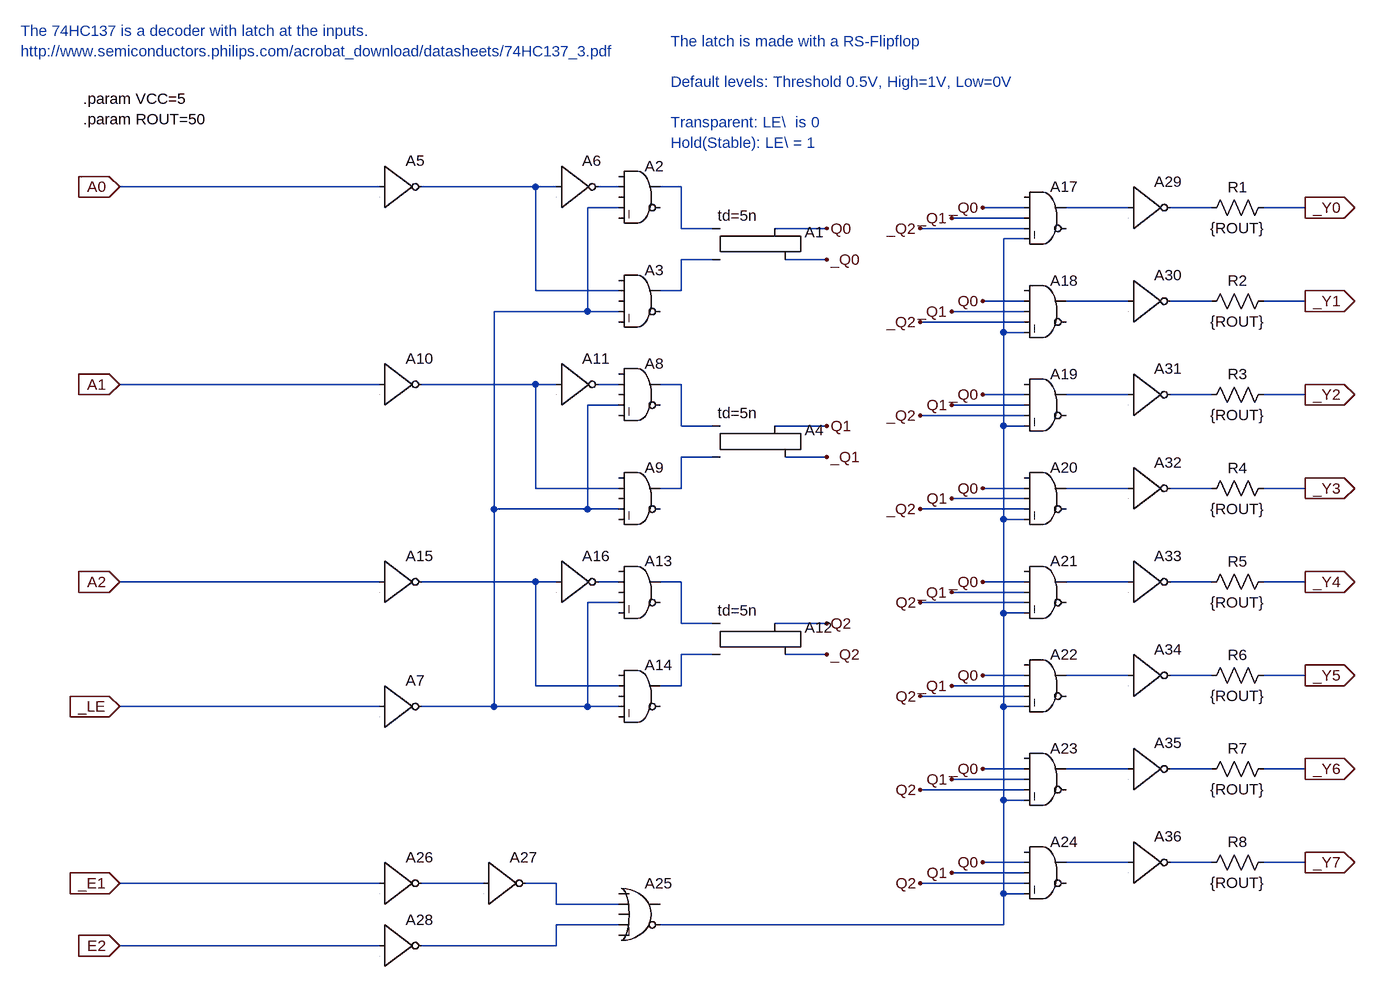
[diagram p0: schematic 74hc137.asc]
74hc137.asc, the LTspice schematic file:
Version 4
SHEET 1 1100 1908
WIRE -64 112 -96 112
WIRE -160 112 -192 112
WIRE -432 112 -832 112
WIRE -192 112 -192 272
WIRE -192 112 -368 112
WIRE -192 272 -64 272
WIRE -64 144 -112 144
WIRE -112 144 -112 304
WIRE -112 304 -64 304
WIRE -112 304 -256 304
WIRE 0 112 32 112
WIRE 32 112 32 176
WIRE 32 176 80 176
WIRE 0 272 32 272
WIRE 32 272 32 224
WIRE 32 224 80 224
WIRE 176 176 256 176
WIRE 192 224 256 224
WIRE -832 912 -432 912
WIRE -64 416 -96 416
WIRE -160 416 -192 416
WIRE -192 416 -192 576
WIRE -192 416 -368 416
WIRE -192 576 -64 576
WIRE -64 448 -112 448
WIRE -112 448 -112 608
WIRE -112 608 -64 608
WIRE 0 416 32 416
WIRE 32 416 32 480
WIRE 32 480 80 480
WIRE 0 576 32 576
WIRE 32 576 32 528
WIRE 32 528 80 528
WIRE 176 480 256 480
WIRE 192 528 256 528
WIRE -64 720 -96 720
WIRE -160 720 -192 720
WIRE -192 720 -192 880
WIRE -192 720 -368 720
WIRE -192 880 -64 880
WIRE -64 752 -112 752
WIRE -112 752 -112 912
WIRE -112 912 -64 912
WIRE 0 720 32 720
WIRE 32 720 32 784
WIRE 32 784 80 784
WIRE 0 880 32 880
WIRE 32 880 32 832
WIRE 32 832 80 832
WIRE 176 784 256 784
WIRE 192 832 256 832
WIRE -432 416 -832 416
WIRE -432 720 -832 720
WIRE 496 144 560 144
WIRE 560 160 448 160
WIRE 560 176 400 176
WIRE 560 192 528 192
WIRE 528 192 528 336
WIRE 496 288 560 288
WIRE 528 336 528 480
WIRE 496 432 560 432
WIRE 560 448 448 448
WIRE 560 464 400 464
WIRE 560 480 528 480
WIRE 528 480 528 624
WIRE 496 576 560 576
WIRE 560 592 448 592
WIRE 560 608 400 608
WIRE 560 624 528 624
WIRE 528 624 528 768
WIRE 496 720 560 720
WIRE 560 736 448 736
WIRE 560 752 400 752
WIRE 560 768 528 768
WIRE 528 768 528 912
WIRE 496 864 560 864
WIRE 560 880 448 880
WIRE 560 896 400 896
WIRE 560 912 528 912
WIRE 528 912 528 1056
WIRE 496 1008 560 1008
WIRE 560 1024 448 1024
WIRE 560 1040 400 1040
WIRE 560 1056 528 1056
WIRE 528 1056 528 1200
WIRE 496 1152 560 1152
WIRE 560 1168 448 1168
WIRE 560 1184 400 1184
WIRE 560 1200 528 1200
WIRE 528 1200 528 1248
WIRE -368 1184 -272 1184
WIRE -208 1184 -160 1184
WIRE -160 1184 -160 1216
WIRE -160 1216 -64 1216
WIRE -64 1248 -160 1248
WIRE -160 1248 -160 1280
WIRE -160 1280 -368 1280
WIRE -432 1184 -832 1184
WIRE -432 1280 -832 1280
WIRE 624 144 720 144
WIRE 624 288 720 288
WIRE 624 432 720 432
WIRE 624 576 720 576
WIRE 624 720 720 720
WIRE 624 864 720 864
WIRE 624 1008 720 1008
WIRE 624 1152 720 1152
WIRE 784 144 848 144
WIRE 784 288 848 288
WIRE 784 432 848 432
WIRE 784 576 848 576
WIRE 784 720 848 720
WIRE 784 864 848 864
WIRE 784 1008 848 1008
WIRE 784 1152 848 1152
WIRE 528 1248 0 1248
WIRE -112 608 -256 608
WIRE -256 608 -256 912
WIRE -256 912 -112 912
WIRE -256 608 -256 304
WIRE -368 912 -256 912
WIRE 560 304 448 304
WIRE 560 320 400 320
WIRE 560 336 528 336
WIRE 928 144 992 144
WIRE 928 288 992 288
WIRE 928 432 992 432
WIRE 928 576 992 576
WIRE 928 720 992 720
WIRE 928 864 992 864
WIRE 928 1008 992 1008
WIRE 928 1152 992 1152
FLAG -832 912 _LE
IOPIN -832 912 In
FLAG -832 112 A0
IOPIN -832 112 In
FLAG 256 176 Q0
FLAG 256 224 _Q0
FLAG 256 480 Q1
FLAG 256 528 _Q1
FLAG 256 784 Q2
FLAG 256 832 _Q2
FLAG -832 416 A1
IOPIN -832 416 In
FLAG -832 720 A2
IOPIN -832 720 In
FLAG 496 144 _Q0
FLAG 448 160 _Q1
FLAG 400 176 _Q2
FLAG 496 288 Q0
FLAG 448 304 _Q1
FLAG 400 320 _Q2
FLAG 496 432 _Q0
FLAG 448 448 Q1
FLAG 400 464 _Q2
FLAG 496 576 Q0
FLAG 448 592 Q1
FLAG 400 608 _Q2
FLAG 496 720 _Q0
FLAG 448 736 _Q1
FLAG 400 752 Q2
FLAG 496 864 Q0
FLAG 448 880 _Q1
FLAG 400 896 Q2
FLAG 496 1008 _Q0
FLAG 448 1024 Q1
FLAG 400 1040 Q2
FLAG 496 1152 Q0
FLAG 448 1168 Q1
FLAG 400 1184 Q2
FLAG 992 144 _Y0
IOPIN 992 144 Out
FLAG 992 288 _Y1
IOPIN 992 288 Out
FLAG 992 432 _Y2
IOPIN 992 432 Out
FLAG 992 576 _Y3
IOPIN 992 576 Out
FLAG 992 720 _Y4
IOPIN 992 720 Out
FLAG 992 864 _Y5
IOPIN 992 864 Out
FLAG 992 1008 _Y6
IOPIN 992 1008 Out
FLAG 992 1152 _Y7
IOPIN 992 1152 Out
FLAG -832 1280 E2
IOPIN -832 1280 In
FLAG -832 1184 _E1
IOPIN -832 1184 In
SYMBOL Digital\\srflop 128 128 R0
WINDOW 39 -40 28 Left 0
SYMATTR SpiceLine td=5n
SYMATTR InstName A1
SYMBOL Digital\\and -32 64 R0
SYMATTR InstName A2
SYMATTR SpiceLine td=5n
SYMBOL Digital\\and -32 224 R0
SYMATTR InstName A3
SYMATTR SpiceLine td=5n
SYMBOL Digital\\inv -432 48 R0
SYMATTR InstName A5
SYMATTR SpiceLine td=5n
SYMATTR SpiceLine2 ref={VCC/2}
SYMBOL Digital\\inv -160 48 R0
SYMATTR InstName A6
SYMBOL Digital\\inv -432 848 R0
SYMATTR InstName A7
SYMATTR SpiceLine td=5n
SYMATTR SpiceLine2 ref={VCC/2}
SYMBOL Digital\\srflop 128 432 R0
WINDOW 39 -40 28 Left 0
SYMATTR SpiceLine td=5n
SYMATTR InstName A4
SYMBOL Digital\\and -32 368 R0
SYMATTR InstName A8
SYMATTR SpiceLine td=5n
SYMBOL Digital\\and -32 528 R0
SYMATTR InstName A9
SYMATTR SpiceLine td=5n
SYMBOL Digital\\inv -432 352 R0
SYMATTR InstName A10
SYMATTR SpiceLine td=5n
SYMATTR SpiceLine2 ref={VCC/2}
SYMBOL Digital\\inv -160 352 R0
SYMATTR InstName A11
SYMBOL Digital\\srflop 128 736 R0
WINDOW 39 -40 28 Left 0
SYMATTR SpiceLine td=5n
SYMATTR InstName A12
SYMBOL Digital\\and -32 672 R0
SYMATTR InstName A13
SYMATTR SpiceLine td=5n
SYMBOL Digital\\and -32 832 R0
SYMATTR InstName A14
SYMATTR SpiceLine td=5n
SYMBOL Digital\\inv -432 656 R0
SYMATTR InstName A15
SYMATTR SpiceLine td=5n
SYMATTR SpiceLine2 ref={VCC/2}
SYMBOL Digital\\inv -160 656 R0
SYMATTR InstName A16
SYMBOL Digital\\and 592 96 R0
SYMATTR InstName A17
SYMATTR SpiceLine td=5n
SYMBOL Digital\\and 592 240 R0
SYMATTR InstName A18
SYMATTR SpiceLine td=5n
SYMBOL Digital\\and 592 384 R0
SYMATTR InstName A19
SYMATTR SpiceLine td=5n
SYMBOL Digital\\and 592 528 R0
SYMATTR InstName A20
SYMATTR SpiceLine td=5n
SYMBOL Digital\\and 592 672 R0
SYMATTR InstName A21
SYMATTR SpiceLine td=5n
SYMBOL Digital\\and 592 816 R0
SYMATTR InstName A22
SYMATTR SpiceLine td=5n
SYMBOL Digital\\and 592 960 R0
SYMATTR InstName A23
SYMATTR SpiceLine td=5n
SYMBOL Digital\\and 592 1104 R0
SYMATTR InstName A24
SYMATTR SpiceLine td=5n
SYMBOL Digital\\or -32 1168 R0
SYMATTR InstName A25
SYMATTR SpiceLine td=5n
SYMBOL Digital\\inv -432 1120 R0
SYMATTR InstName A26
SYMATTR SpiceLine td=5n
SYMATTR SpiceLine2 ref={VCC/2}
SYMBOL Digital\\inv -272 1120 R0
SYMATTR InstName A27
SYMBOL Digital\\inv -432 1216 R0
SYMATTR InstName A28
SYMATTR SpiceLine td=5n
SYMATTR SpiceLine2 ref={VCC/2}
SYMBOL Digital\\inv 720 80 R0
SYMATTR InstName A29
SYMATTR SpiceLine td=5n
SYMATTR SpiceLine2 ref=0.5  vlow=0 vhigh={VCC}
SYMBOL Digital\\inv 720 224 R0
SYMATTR InstName A30
SYMATTR SpiceLine td=5n
SYMATTR SpiceLine2 ref=0.5  vlow=0 vhigh={VCC}
SYMBOL Digital\\inv 720 368 R0
SYMATTR InstName A31
SYMATTR SpiceLine td=5n
SYMATTR SpiceLine2 ref=0.5  vlow=0 vhigh={VCC}
SYMBOL Digital\\inv 720 512 R0
SYMATTR InstName A32
SYMATTR SpiceLine td=5n
SYMATTR SpiceLine2 ref=0.5  vlow=0 vhigh={VCC}
SYMBOL Digital\\inv 720 656 R0
SYMATTR InstName A33
SYMATTR SpiceLine td=5n
SYMATTR SpiceLine2 ref=0.5  vlow=0 vhigh={VCC}
SYMBOL Digital\\inv 720 800 R0
SYMATTR InstName A34
SYMATTR SpiceLine td=5n
SYMATTR SpiceLine2 ref=0.5  vlow=0 vhigh={VCC}
SYMBOL Digital\\inv 720 944 R0
SYMATTR InstName A35
SYMATTR SpiceLine td=5n
SYMATTR SpiceLine2 ref=0.5  vlow=0 vhigh={VCC}
SYMBOL Digital\\inv 720 1088 R0
SYMATTR InstName A36
SYMATTR SpiceLine td=5n
SYMATTR SpiceLine2 ref=0.5  vlow=0 vhigh={VCC}
SYMBOL res 832 160 R270
WINDOW 0 32 56 VTop 0
WINDOW 3 0 56 VBottom 0
SYMATTR InstName R1
SYMATTR Value {ROUT}
SYMBOL res 832 304 R270
WINDOW 0 32 56 VTop 0
WINDOW 3 0 56 VBottom 0
SYMATTR InstName R2
SYMATTR Value {ROUT}
SYMBOL res 832 448 R270
WINDOW 0 32 56 VTop 0
WINDOW 3 0 56 VBottom 0
SYMATTR InstName R3
SYMATTR Value {ROUT}
SYMBOL res 832 592 R270
WINDOW 0 32 56 VTop 0
WINDOW 3 0 56 VBottom 0
SYMATTR InstName R4
SYMATTR Value {ROUT}
SYMBOL res 832 736 R270
WINDOW 0 32 56 VTop 0
WINDOW 3 0 56 VBottom 0
SYMATTR InstName R5
SYMATTR Value {ROUT}
SYMBOL res 832 880 R270
WINDOW 0 32 56 VTop 0
WINDOW 3 0 56 VBottom 0
SYMATTR InstName R6
SYMATTR Value {ROUT}
SYMBOL res 832 1024 R270
WINDOW 0 32 56 VTop 0
WINDOW 3 0 56 VBottom 0
SYMATTR InstName R7
SYMATTR Value {ROUT}
SYMBOL res 832 1168 R270
WINDOW 0 32 56 VTop 0
WINDOW 3 0 56 VBottom 0
SYMATTR InstName R8
SYMATTR Value {ROUT}
TEXT 16 -112 Left 0 ;The latch is made with a RS-Flipflop\n \nDefault levels: Threshold 0.5V, High=1V, Low=0V\n \nTransparent: LE\\  is 0\nHold(Stable): LE\\ = 1
TEXT -984 -128 Left 0 ;The 74HC137 is a decoder with latch at the inputs.\nhttp://www.semiconductors.philips.com/acrobat_download/datasheets/74HC137_3.pdf
TEXT -888 -24 Left 0 !.param VCC=5
TEXT -888 8 Left 0 !.param ROUT=50

The netlist it stands for:
* 74hc137.asc
A1 N004 N005 0 0 0 _Q0 Q0 0 SRFLOP td=5n
A2 0 N001 0 N003 0 0 N004 0 AND td=5n
A3 0 N002 0 N003 0 0 N005 0 AND td=5n
A5 A0 0 0 0 0 N002 0 0 BUF td=5n ref={VCC/2}
A6 N002 0 0 0 0 N001 0 0 BUF
A7 _LE 0 0 0 0 N003 0 0 BUF td=5n ref={VCC/2}
A4 N008 N009 0 0 0 _Q1 Q1 0 SRFLOP td=5n
A8 0 N006 0 N003 0 0 N008 0 AND td=5n
A9 0 N007 0 N003 0 0 N009 0 AND td=5n
A10 A1 0 0 0 0 N007 0 0 BUF td=5n ref={VCC/2}
A11 N007 0 0 0 0 N006 0 0 BUF
A12 N012 N013 0 0 0 _Q2 Q2 0 SRFLOP td=5n
A13 0 N010 0 N003 0 0 N012 0 AND td=5n
A14 0 N011 0 N003 0 0 N013 0 AND td=5n
A15 A2 0 0 0 0 N011 0 0 BUF td=5n ref={VCC/2}
A16 N011 0 0 0 0 N010 0 0 BUF
A17 0 _Q0 _Q1 _Q2 N014 0 N018 0 AND td=5n
A18 0 Q0 _Q1 _Q2 N014 0 N019 0 AND td=5n
A19 0 _Q0 Q1 _Q2 N014 0 N020 0 AND td=5n
A20 0 Q0 Q1 _Q2 N014 0 N021 0 AND td=5n
A21 0 _Q0 _Q1 Q2 N014 0 N022 0 AND td=5n
A22 0 Q0 _Q1 Q2 N014 0 N023 0 AND td=5n
A23 0 _Q0 Q1 Q2 N014 0 N024 0 AND td=5n
A24 0 Q0 Q1 Q2 N014 0 N025 0 AND td=5n
A25 0 N016 0 N017 0 N014 0 0 OR td=5n
A26 _E1 0 0 0 0 N015 0 0 BUF td=5n ref={VCC/2}
A27 N015 0 0 0 0 N016 0 0 BUF
A28 E2 0 0 0 0 N017 0 0 BUF td=5n ref={VCC/2}
A29 N018 0 0 0 0 N026 0 0 BUF td=5n ref=0.5  vlow=0 vhigh={VCC}
A30 N019 0 0 0 0 N027 0 0 BUF td=5n ref=0.5  vlow=0 vhigh={VCC}
A31 N020 0 0 0 0 N028 0 0 BUF td=5n ref=0.5  vlow=0 vhigh={VCC}
A32 N021 0 0 0 0 N029 0 0 BUF td=5n ref=0.5  vlow=0 vhigh={VCC}
A33 N022 0 0 0 0 N030 0 0 BUF td=5n ref=0.5  vlow=0 vhigh={VCC}
A34 N023 0 0 0 0 N031 0 0 BUF td=5n ref=0.5  vlow=0 vhigh={VCC}
A35 N024 0 0 0 0 N032 0 0 BUF td=5n ref=0.5  vlow=0 vhigh={VCC}
A36 N025 0 0 0 0 N033 0 0 BUF td=5n ref=0.5  vlow=0 vhigh={VCC}
R1 N026 _Y0 {ROUT}
R2 N027 _Y1 {ROUT}
R3 N028 _Y2 {ROUT}
R4 N029 _Y3 {ROUT}
R5 N030 _Y4 {ROUT}
R6 N031 _Y5 {ROUT}
R7 N032 _Y6 {ROUT}
R8 N033 _Y7 {ROUT}
* The latch is made with a RS-Flipflop
* Default levels: Threshold 0.5V, High=1V, Low=0V
* Transparent: LE\  is 0
* Hold(Stable): LE\ = 1
* The 74HC137 is a decoder with latch at the inputs.
* http://www.semiconductors.philips.com/acrobat_download/datasheets/74HC137_3.pdf
.param VCC=5
.param ROUT=50
.backanno
.end